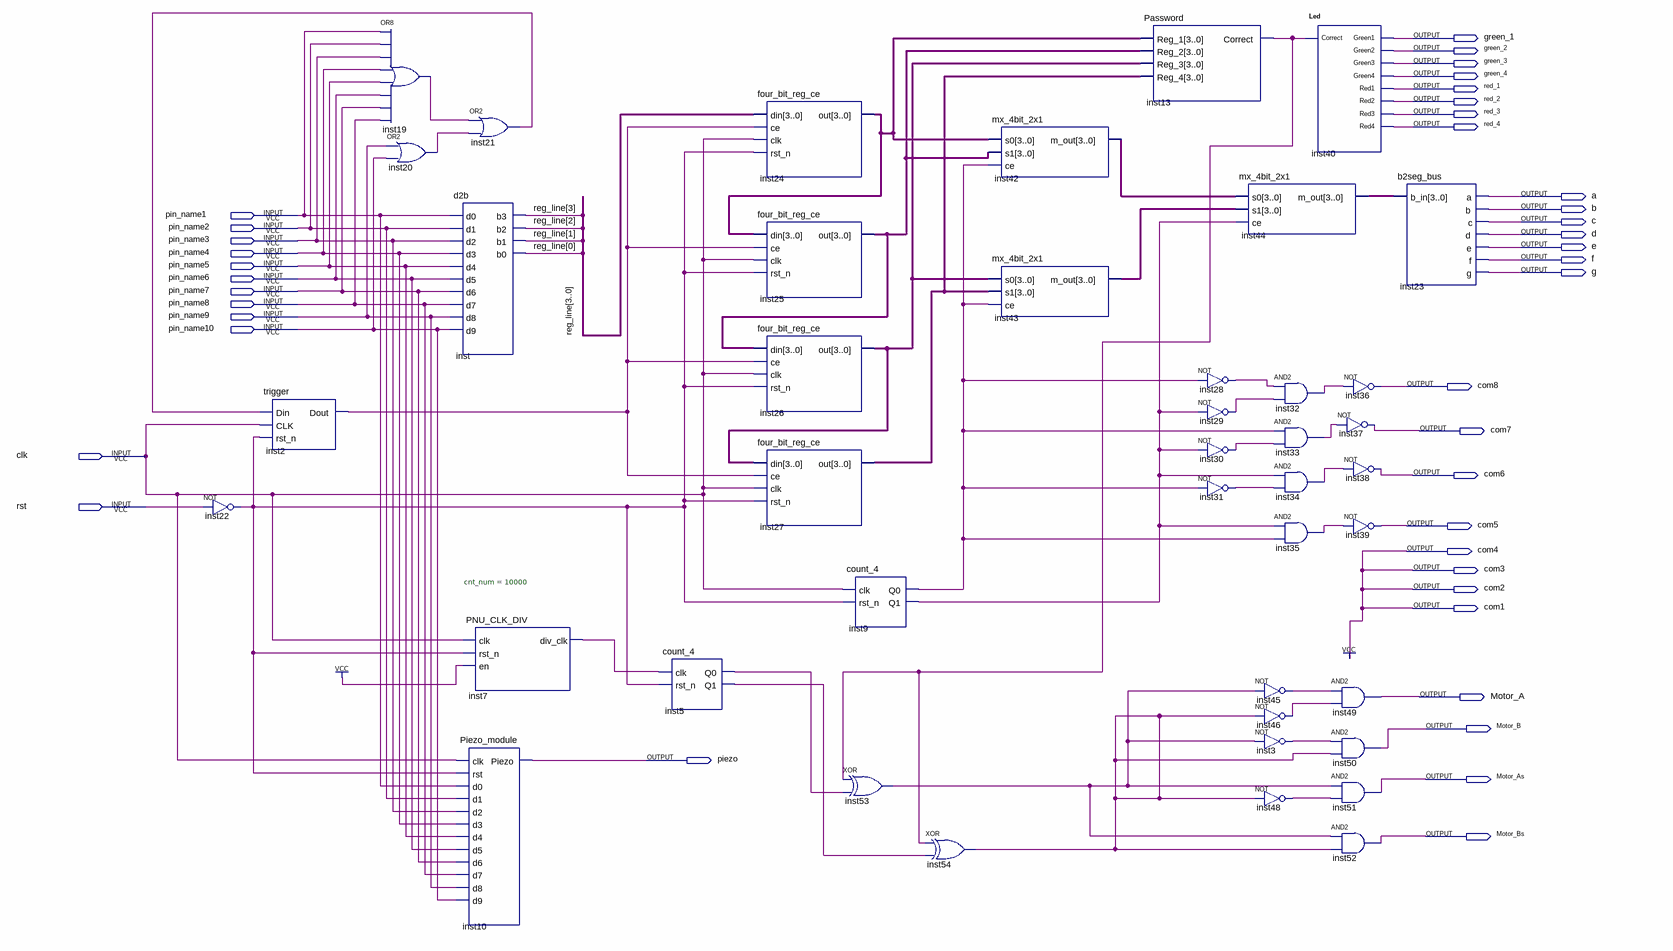
[diagram p0: schematic sheet]
// Quartus schematic ten_week_2.bdf as structural Verilog: 42 symbols, 40 pins
module ten_week_2 (
  input  pin_name1,
  input  pin_name2,
  input  pin_name3,
  input  pin_name4,
  input  pin_name5,
  input  pin_name6,
  input  pin_name7,
  input  pin_name8,
  input  pin_name9,
  input  pin_name10,
  input  clk,
  input  rst,
  output green_1,
  output green_2,
  output green_3,
  output green_4,
  output red_1,
  output red_2,
  output red_3,
  output red_4,
  output a,
  output b,
  output c,
  output d,
  output e,
  output f,
  output g,
  output com8,
  output com7,
  output com6,
  output com5,
  output com4,
  output com3,
  output com2,
  output com1,
  output Motor_A,
  output Motor_B,
  output piezo,
  output Motor_As,
  output Motor_Bs
);

  wire inst2_dout, inst3_out, inst5_q0, inst5_q1, inst7_div_clk, inst9_q0, inst9_q1, inst13_correct,
       inst19_out, inst20_out, inst21_out, inst22_out, inst28_out, inst29_out, inst30_out, inst31_out,
       inst32_out, inst33_out, inst34_out, inst35_out, inst45_out, inst46_out, inst48_out, inst53_out,
       inst54_out;
  wire [3:0] inst24_out, inst25_out, inst26_out, inst27_out, inst42_m_out, inst43_m_out, inst44_m_out,
       reg_line;

  not inst22 (inst22_out, rst);
  trigger inst2 (.Din(inst21_out), .CLK(clk), .rst_n(inst22_out), .Dout(inst2_dout));
  or inst19 (inst19_out, pin_name1, pin_name2, pin_name3, pin_name4, pin_name5, pin_name6, pin_name7, pin_name8);
  or inst20 (inst20_out, pin_name9, pin_name10);
  d2b inst (
    .d0(pin_name1), .d1(pin_name2), .d2(pin_name3), .d3(pin_name4), .d4(pin_name5), .d5(pin_name6),
    .d6(pin_name7), .d7(pin_name8), .d8(pin_name9), .d9(pin_name10), .b3(reg_line[3]), .b2(reg_line[2]),
    .b1(reg_line[1]), .b0(reg_line[0]));
  Piezo_module inst10 (
    .clk(clk), .rst(inst22_out), .d0(pin_name1), .d1(pin_name2), .d2(pin_name3), .d3(pin_name4),
    .d4(pin_name5), .d5(pin_name6), .d6(pin_name7), .d7(pin_name8), .d8(pin_name9), .d9(pin_name10),
    .Piezo(piezo));
  or inst21 (inst21_out, inst19_out, inst20_out);
  PNU_CLK_DIV #(.cnt_num(10000)) inst7 (.clk(clk), .rst_n(inst22_out), .en(1'b1), .div_clk(inst7_div_clk));
  count_4 inst5 (.clk(inst7_div_clk), .rst_n(inst22_out), .Q0(inst5_q0), .Q1(inst5_q1));
  four_bit_reg_ce inst24 (.din(reg_line), .ce(inst2_dout), .clk(clk), .rst_n(inst22_out), .out(inst24_out));
  four_bit_reg_ce inst25 (.din(inst24_out), .ce(inst2_dout), .clk(clk), .rst_n(inst22_out), .out(inst25_out));
  four_bit_reg_ce inst26 (.din(inst25_out), .ce(inst2_dout), .clk(clk), .rst_n(inst22_out), .out(inst26_out));
  four_bit_reg_ce inst27 (.din(inst26_out), .ce(inst2_dout), .clk(clk), .rst_n(inst22_out), .out(inst27_out));
  count_4 inst9 (.clk(clk), .rst_n(inst22_out), .Q0(inst9_q0), .Q1(inst9_q1));
  xor inst53 (inst53_out, inst13_correct, inst5_q0);
  xor inst54 (inst54_out, inst13_correct, inst5_q1);
  mx_4bit_2x1 inst42 (.s0(inst24_out), .s1(inst25_out), .ce(inst9_q0), .m_out(inst42_m_out));
  mx_4bit_2x1 inst43 (.s0(inst26_out), .s1(inst27_out), .ce(inst9_q0), .m_out(inst43_m_out));
  Password inst13 (
    .Reg_1(inst24_out), .Reg_2(inst25_out), .Reg_3(inst26_out), .Reg_4(inst27_out), .Correct(inst13_correct));
  not inst28 (inst28_out, inst9_q0);
  not inst29 (inst29_out, inst9_q1);
  not inst30 (inst30_out, inst9_q1);
  not inst31 (inst31_out, inst9_q0);
  mx_4bit_2x1 inst44 (.s0(inst42_m_out), .s1(inst43_m_out), .ce(inst9_q1), .m_out(inst44_m_out));
  not inst45 (inst45_out, inst53_out);
  not inst46 (inst46_out, inst54_out);
  not inst3 (inst3_out, inst53_out);
  not inst48 (inst48_out, inst54_out);
  Led inst40 (
    .Correct(inst13_correct), .Green1(green_1), .Green2(green_2), .Green3(green_3), .Green4(green_4),
    .Red1(red_1), .Red2(red_2), .Red3(red_3), .Red4(red_4));
  and inst32 (inst32_out, inst28_out, inst29_out);
  and inst33 (inst33_out, inst9_q0, inst30_out);
  and inst34 (inst34_out, inst9_q1, inst31_out);
  and inst35 (inst35_out, inst9_q1, inst9_q0);
  not inst36 (com8, inst32_out);
  not inst37 (com7, inst33_out);
  not inst38 (com6, inst34_out);
  not inst39 (com5, inst35_out);
  and inst49 (Motor_A, inst45_out, inst46_out);
  and inst50 (Motor_B, inst3_out, inst54_out);
  and inst51 (Motor_As, inst53_out, inst48_out);
  and inst52 (Motor_Bs, inst53_out, inst54_out);
  b2seg_bus inst23 (.b_in(inst44_m_out), .a(a), .b(b), .c(c), .d(d), .e(e), .f(f), .g(g));

  assign com1 = 1'b1;
  assign com2 = 1'b1;
  assign com3 = 1'b1;
  assign com4 = 1'b1;
endmodule
